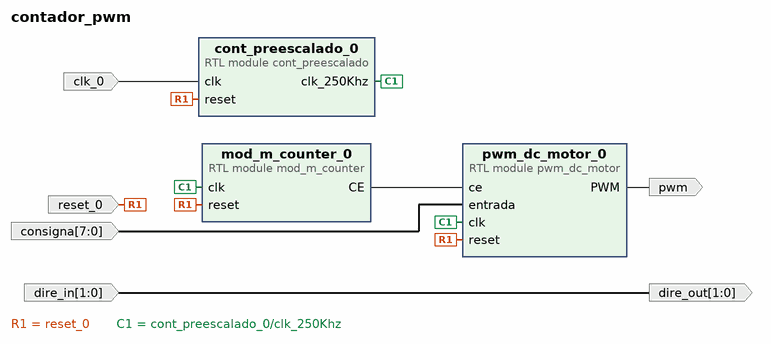
[diagram p0: block diagram of the top level]
# Vivado block design contador_pwm, xc7z010clg400-1, Vivado 2017.4
create_bd_design contador_pwm

create_bd_port -dir I -type clk clk_0
create_bd_port -dir I -type rst reset_0
create_bd_port -dir I -from 7 -to 0 consigna
create_bd_port -dir I -from 1 -to 0 dire_in
create_bd_port -dir O -from 1 -to 0 dire_out
create_bd_port -dir O pwm

create_bd_cell -type module -reference pwm_dc_motor pwm_dc_motor_0
create_bd_cell -type module -reference mod_m_counter mod_m_counter_0
create_bd_cell -type module -reference cont_preescalado cont_preescalado_0

# ---- connections ----

connect_bd_net -net clk_0_1 [get_bd_ports clk_0] [get_bd_pins cont_preescalado_0/clk]
connect_bd_net -net reset_0_1 [get_bd_ports reset_0] \
  [get_bd_pins pwm_dc_motor_0/reset] [get_bd_pins mod_m_counter_0/reset] [get_bd_pins cont_preescalado_0/reset]
connect_bd_net [get_bd_pins cont_preescalado_0/clk_250Khz] [get_bd_pins mod_m_counter_0/clk] [get_bd_pins pwm_dc_motor_0/clk]
connect_bd_net [get_bd_pins mod_m_counter_0/CE] [get_bd_pins pwm_dc_motor_0/ce]
connect_bd_net [get_bd_ports consigna] [get_bd_pins pwm_dc_motor_0/entrada]
connect_bd_net [get_bd_pins pwm_dc_motor_0/PWM] [get_bd_ports pwm]
connect_bd_net [get_bd_ports dire_in] [get_bd_ports dire_out]

validate_bd_design
save_bd_design
